# Altium schematic sheet 03_ENET.SchDoc
size A4
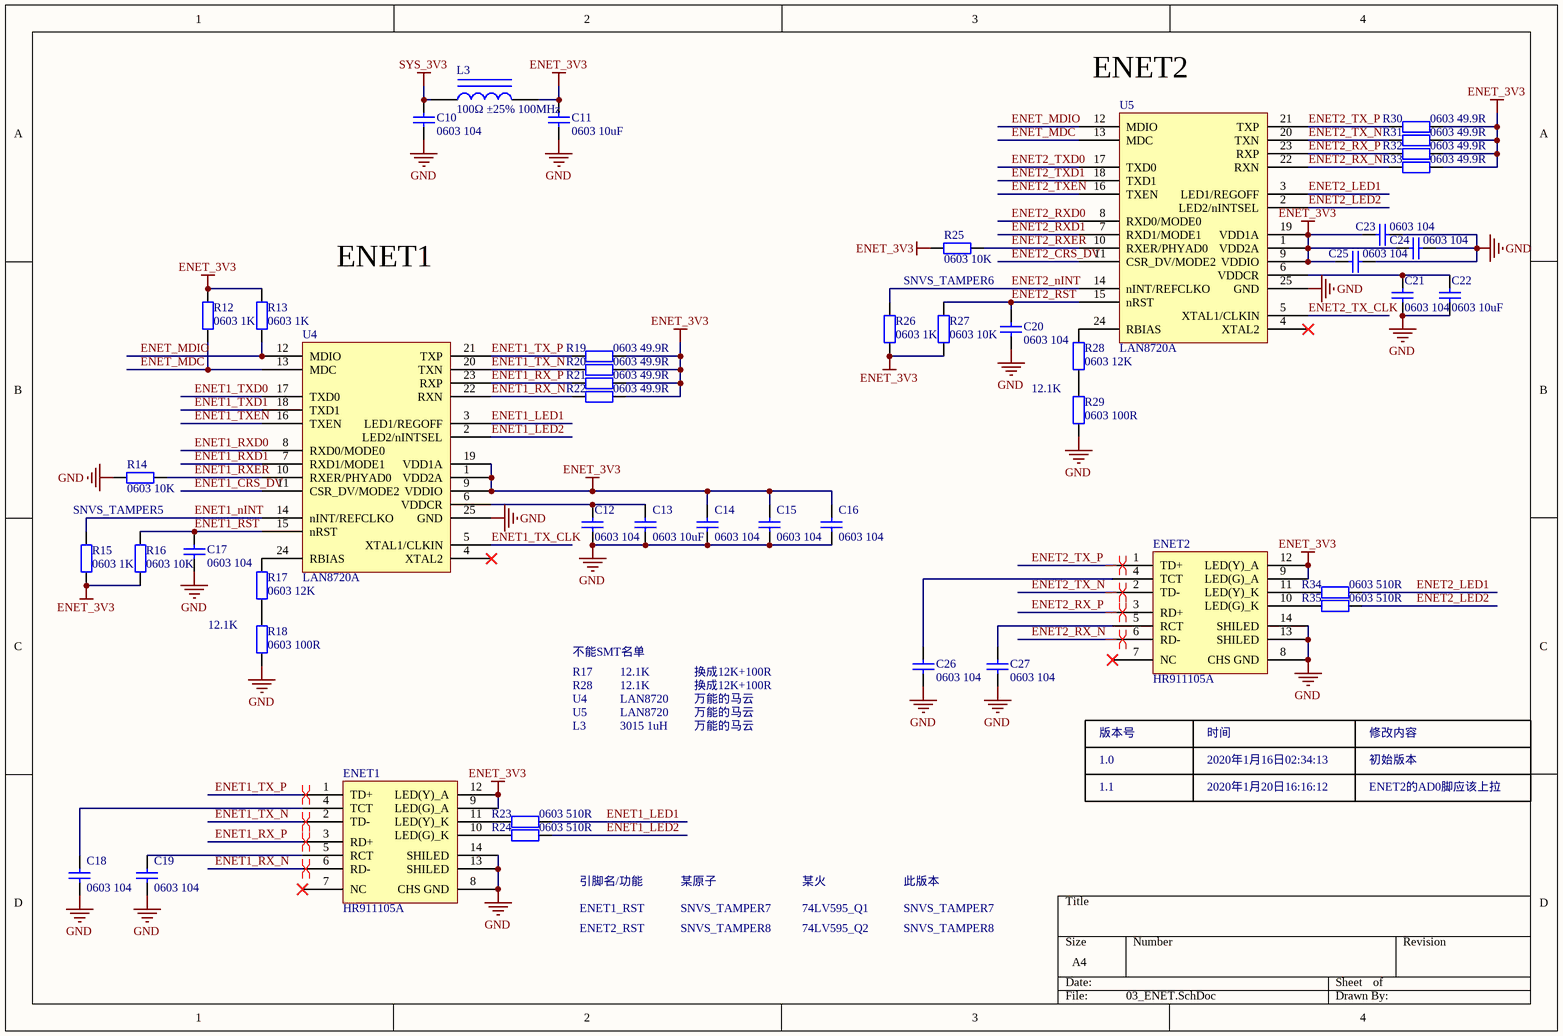
[diagram p0: 03_ENET.SchDoc]

## Parts
C10  0603 104  [LC-0603_C]
C11  0603 10uF  [LC-0603_C]
C12  0603 104  [LC-0603_C]
C13  0603 10uF  [LC-0603_C]
C14  0603 104  [LC-0603_C]
C15  0603 104  [LC-0603_C]
C16  0603 104  [LC-0603_C]
C17  0603 104  [LC-0603_C]
C18  0603 104  [LC-0603_C]
C19  0603 104  [LC-0603_C]
C20  0603 104  [LC-0603_C]
C21  0603 104  [LC-0603_C]
C22  0603 10uF  [LC-0603_C]
C23  0603 104  [LC-0603_C]
C24  0603 104  [LC-0603_C]
C25  0603 104  [LC-0603_C]
C26  0603 104  [LC-0603_C]
C27  0603 104  [LC-0603_C]
ENET1  HR911105A  [HR911105A]
ENET2  HR911105A  [HR911105A]
L3  100Ω ±25% 100MHz  [LC-0805_L]
R12  0603 1K  [LC-0603_R]
R13  0603 1K  [LC-0603_R]
R14  0603 10K  [LC-0603_R]
R15  0603 1K  [LC-0603_R]
R16  0603 10K  [LC-0603_R]
R17  0603 12K  [LC-0603_R]
R18  0603 100R  [LC-0603_R]
R19  0603 49.9R  [LC-0603_R]
R20  0603 49.9R  [LC-0603_R]
R21  0603 49.9R  [LC-0603_R]
R22  0603 49.9R  [LC-0603_R]
R23  0603 510R  [LC-0603_R]
R24  0603 510R  [LC-0603_R]
R25  0603 10K  [LC-0603_R]
R26  0603 1K  [LC-0603_R]
R27  0603 10K  [LC-0603_R]
R28  0603 12K  [LC-0603_R]
R29  0603 100R  [LC-0603_R]
R30  0603 49.9R  [LC-0603_R]
R31  0603 49.9R  [LC-0603_R]
R32  0603 49.9R  [LC-0603_R]
R33  0603 49.9R  [LC-0603_R]
R34  0603 510R  [LC-0603_R]
R35  0603 510R  [LC-0603_R]
U4  LAN8720A  [QFN-24_4x4x05P]
U5  LAN8720A  [QFN-24_4x4x05P]

## Nets
ENET_3V3: C11.2 C14.2 C15.2 C16.2 C23.2 C24.2 C25.2 ENET1.9(LED(G)_A) ENET1.12(LED(Y)_A) ENET2.9(LED(G)_A) ENET2.12(LED(Y)_A) L3.2 R12.2 R13.2 R15.2 R16.2 R19.2 R20.2 R21.2 R22.2 R25.2 R26.2 R27.2 R30.2 R31.2 R32.2 R33.2 U4.1(VDD2A) U4.9(VDDIO) U4.19(VDD1A) U5.1(VDD2A) U5.9(VDDIO) U5.19(VDD1A)
GND: C10.1 C11.1 C12.1 C13.1 C14.1 C15.1 C16.1 C17.1 C18.1 C19.1 C20.1 C21.1 C22.1 C23.1 C24.1 C25.1 C26.2 C27.2 ENET1.8(CHS_GND) ENET1.13(SHILED) ENET1.14(SHILED) ENET2.8(CHS_GND) ENET2.13(SHILED) ENET2.14(SHILED) R14.2 R18.2 R29.2 U4.25(GND) U5.25(GND)
SYS_3V3: C10.2 L3.1
ENET1_CRS_DV: U4.11(CSR_DV/MODE2)
ENET1_LED1: R23.2 U4.3(LED1/REGOFF)
ENET1_LED2: R24.2 U4.2(LED2/nINTSEL)
ENET1_nINT: R15.1 U4.14(nINT/REFCLKO)
ENET1_RST: C17.2 R16.1 U4.15(nRST)
ENET1_RX_N: ENET1.6(RD-) R22.1 U4.22(RXN)
ENET1_RX_P: ENET1.3(RD+) R21.1 U4.23(RXP)
ENET1_RXD0: U4.8(RXD0/MODE0)
ENET1_RXD1: U4.7(RXD1/MODE1)
ENET1_RXER: R14.1 U4.10(RXER/PHYAD0)
ENET1_TX_CLK: U4.5(XTAL1/CLKIN)
ENET1_TX_N: ENET1.2(TD-) R20.1 U4.20(TXN)
ENET1_TX_P: ENET1.1(TD+) R19.1 U4.21(TXP)
ENET1_TXD0: U4.17(TXD0)
ENET1_TXD1: U4.18(TXD1)
ENET1_TXEN: U4.16(TXEN)
ENET2_CRS_DV: U5.11(CSR_DV/MODE2)
ENET2_LED1: R34.2 U5.3(LED1/REGOFF)
ENET2_LED2: R35.2 U5.2(LED2/nINTSEL)
ENET2_nINT: R26.1 U5.14(nINT/REFCLKO)
ENET2_RST: C20.2 R27.1 U5.15(nRST)
ENET2_RX_N: ENET2.6(RD-) R33.1 U5.22(RXN)
ENET2_RX_P: ENET2.3(RD+) R32.1 U5.23(RXP)
ENET2_RXD0: U5.8(RXD0/MODE0)
ENET2_RXD1: U5.7(RXD1/MODE1)
ENET2_RXER: R25.1 U5.10(RXER/PHYAD0)
ENET2_TX_CLK: U5.5(XTAL1/CLKIN)
ENET2_TX_N: ENET2.2(TD-) R31.1 U5.20(TXN)
ENET2_TX_P: ENET2.1(TD+) R30.1 U5.21(TXP)
ENET2_TXD0: U5.17(TXD0)
ENET2_TXD1: U5.18(TXD1)
ENET2_TXEN: U5.16(TXEN)
ENET_MDC: R12.1 U4.13(MDC) U5.13(MDC)
ENET_MDIO: R13.1 U4.12(MDIO) U5.12(MDIO)
NetC12_2: C12.2 C13.2 U4.6(VDDCR)
NetC18_2: C18.2 ENET1.4(TCT)
NetC19_2: C19.2 ENET1.5(RCT)
NetC21_2: C21.2 C22.2 U5.6(VDDCR)
NetC26_1: C26.1 ENET2.4(TCT)
NetC27_1: C27.1 ENET2.5(RCT)
NetENET1_10: ENET1.10(LED(G)_K) R24.1
NetENET1_11: ENET1.11(LED(Y)_K) R23.1
NetENET2_10: ENET2.10(LED(G)_K) R35.1
NetENET2_11: ENET2.11(LED(Y)_K) R34.1
NetR17_1: R17.1 U4.24(RBIAS)
NetR17_2: R17.2 R18.1
NetR28_1: R28.1 U5.24(RBIAS)
NetR28_2: R28.2 R29.1

Not connected (* = marked no-connect by the designer): ENET1 7(NC)*; ENET2 7(NC)*; U4 4(XTAL2)*; U5 4(XTAL2)*

## Layout directives
differential pair: ENET1_RX_N, ENET1_RX_P, ENET1_TX_N, ENET1_TX_P, ENET2_RX_N, ENET2_RX_P, ENET2_TX_N, ENET2_TX_P

## Notes on the sheet
- (near U5) ENET2
- ENET1
- SNVS_TAMPER6
- 12.1K
- SNVS_TAMPER5
- 不能SMT名单
- R17
- R28
- U4
- U5
- LAN8720
- 换成12K+100R
- 万能的马云
- L3
- 3015 1uH
- 版本号
- 1.0
- 1.1
- 2020年1月16日02:34:13
- 时间
- 2020年1月20日16:16:12
- 修改内容
- 初始版本
- ENET2的AD0脚应该上拉
- ENET1_RST
- 引脚名/功能
- SNVS_TAMPER7
- 某原子
- 74LV595_Q1
- 某火
- 此版本
- ENET2_RST
- SNVS_TAMPER8
- 74LV595_Q2

## Library data of the parts
C10-C27 = 0603 1.5nF (152) 10% 50V: 贴片电容; ComponentLink1Description: 供应商链接; ComponentLink1URL: http://www.szlcsc.com/product/details_1947.html; Package: 0603; Supplier: LC; SuppliersPartNumber: C1595
L3 = 0805 100Ω 25% 100MHz: 贴片磁珠; ComponentLink1URL: http://www.szlcsc.com/product/details_1367.html; Package: 0805; Supplier: LC; SuppliersPartNumber: C1015
R12-R35 = 0603 1.1KΩ (1101) 1%: 贴片电阻; ComponentLink1Description: 供应商链接; ComponentLink1URL: http://www.szlcsc.com/product/details_23491.html; Package: 0603; Supplier: LC; SuppliersPartNumber: C22764